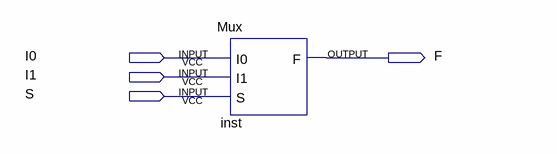
[diagram p0: schematic sheet]
// Quartus schematic Block_for_mux.bdf as structural Verilog: 1 symbols, 4 pins
module Block_for_mux (
  input  I0,
  input  I1,
  input  S,
  output F
);

  Mux inst (.F(F));  // open: I0, I1, S
endmodule
